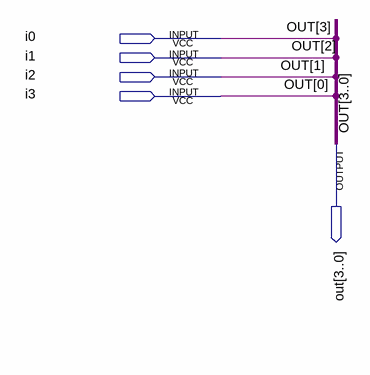
[diagram p0: schematic sheet]
// Quartus schematic reverse_internal.bdf as structural Verilog: 0 symbols, 5 pins
module reverse_internal (
  input  i0,
  input  i1,
  input  i2,
  input  i3,
  output [3:0] out
);


  assign out = {i0, i1, i2, i3};
endmodule
